# Altium schematic sheet micro.SchDoc
size A3
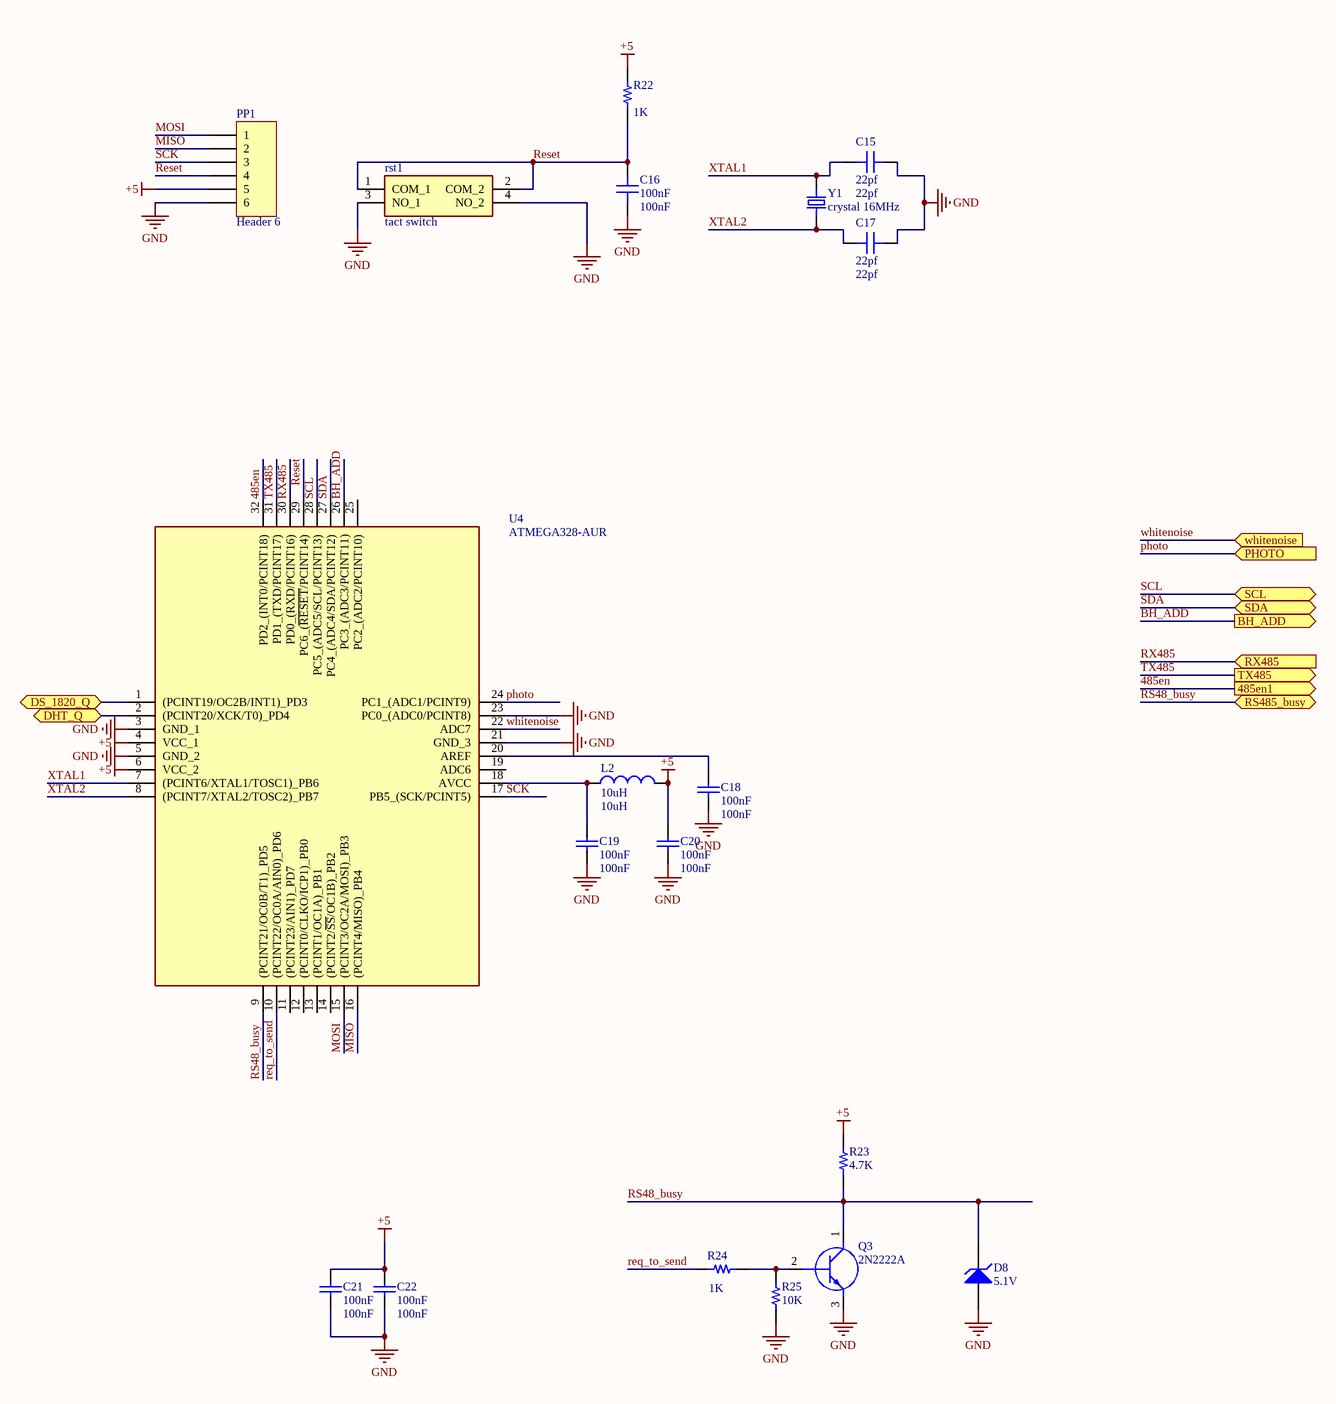
[diagram p0: micro.SchDoc]

## Parts
C15  22pf  [0603C]
C16  100nF  [0603C]
C17  22pf  [0603C]
C18  100nF  [0603C]
C19  100nF  [0603C]
C20  100nF  [0603C]
C21  100nF  [0603C]
C22  100nF  [0603C]
D8  5.1V  [Diode 1n4148 SMD]
L2  10uH  [IND1206]
PP1  Header 6  [HDR1X6]
Q3  2N2222A  [soT95p280x130-3n]
R22  1K  [0603R]
R23  4.7K  [0603R]
R24  1K  [0603R]
R25  10K  [0603R]
rst1  tact switch  [DTSM63NVB]
U4  ATMEGA328-AUR  [TQFP32_N]
Y1  crystal 16MHz  [XTAL_ECS-180-S-5P-DN-TR]

## Ports
485en1 (out), BH_ADD (out), DHT_Q (bidir), DS_1820_Q (bidir), PHOTO (in), RS485_busy (bidir), RX485 (in), SCL (bidir), SDA (bidir), TX485 (out), whitenoise (in)

## Nets
+5: C20.1 C21.1 C22.1 L2.2 PP1.5 R22.2 R23.1 U4.4(VCC_1) U4.6(VCC_2)
GND: C15.1 C16.2 C17.1 C18.2 C19.2 C20.2 C21.2 C22.2 D8.1(A) PP1.6 Q3.3(E) R25.2 rst1.3(NO_1) rst1.4(NO_2) U4.3(GND_1) U4.5(GND_2) U4.21(GND_3) U4.23(PC0_(ADC0/PCINT8))
485en: U4.32(PD2_(INT0/PCINT18)) ; port 485en1
BH_ADD: U4.26(PC3_(ADC3/PCINT11)) ; port BH_ADD
DHT_Q: U4.2((PCINT20/XCK/T0)_PD4) ; port DHT_Q
DS_1820_Q: U4.1((PCINT19/OC2B/INT1)_PD3) ; port DS_1820_Q
MISO: PP1.2 U4.16((PCINT4/MISO)_PB4)
MOSI: PP1.1 U4.15((PCINT3/OC2A/MOSI)_PB3)
photo: U4.24(PC1_(ADC1/PCINT9)) ; port PHOTO
req_to_send: R24.2 U4.10((PCINT22/OC0A/AIN0)_PD6)
Reset: C16.1 PP1.4 R22.1 rst1.1(COM_1) rst1.2(COM_2) U4.29(PC6_(~{RESET}/PCINT14))
RS48_busy: D8.2(K) Q3.1(C) R23.2 U4.9((PCINT21/OC0B/T1)_PD5) ; port RS485_busy
RX485: U4.30(PD0_(RXD/PCINT16)) ; port RX485
SCK: PP1.3 U4.17(PB5_(SCK/PCINT5))
SCL: U4.28(PC5_(ADC5/SCL/PCINT13)) ; port SCL
SDA: U4.27(PC4_(ADC4/SDA/PCINT12)) ; port SDA
TX485: U4.31(PD1_(TXD/PCINT17)) ; port TX485
whitenoise: U4.22(ADC7) ; port whitenoise
XTAL1: C15.2 U4.7((PCINT6/XTAL1/TOSC1)_PB6) Y1.2
XTAL2: C17.2 U4.8((PCINT7/XTAL2/TOSC2)_PB7) Y1.1
NetC18_1: C18.1 U4.20(AREF)
NetC19_1: C19.1 L2.1 U4.18(AVCC)
NetQ3_2: Q3.2(B) R24.1 R25.1

Not connected (* = marked no-connect by the designer): U4 11((PCINT23/AIN1)_PD7) 12((PCINT0/CLKO/ICP1)_PB0) 13((PCINT1/OC1A)_PB1) 14((PCINT2/~{SS}/OC1B)_PB2) 19(ADC6) 25(PC2_(ADC2/PCINT10))

## Library data of the parts
C15-C17 = Capacitor: CAP SMD 0603; Part Number: C0805X106K9RAC7800
  C15 C17: Value: 22pf
  C16: Value: 100nF
C18-C22 = Cap: CAP SMD 0603; Published: 8-Jun-2000; LatestRevisionDate: 17-Jul-2002; LatestRevisionNote: Re-released for DXP Platform.; PackageReference: RAD-0.3; Publisher: Altium Limited; PackageDescription: Radial Cap, Thru-Hole; 2 Leads; 0.3 in Pin Spacing; Value: 100nF
D8 = D Zener: Zener Diode 5.1v; Published: 8-Jun-2000; LatestRevisionDate: 17-Jul-2002; LatestRevisionNote: Re-released for DXP Platform.; PackageReference: DIODE-0.7; Publisher: Altium Limited; PackageDescription: Diode, Thru-Hole; 2 Leads; 0.7 in Pin Spacing
L2 = Inductor: Inductor 1206; Code_IEC: 1005; Published: 8-Jun-2000; LatestRevisionDate: 29-May-2009; LatestRevisionNote: IPC-7351 Footprint Added.; PackageReference: 0402-A; Publisher: Altium Limited; PackageDescription: Chip Inductor; Code_JEITA: 0402; Value: 10uH
PP1 = Header 6: Header, 6-Pin , female; LatestRevisionDate: 17-Jul-2002; LatestRevisionNote: Re-released for DXP Platform.; Publisher: Altium Limited
Q3 = 2N2222A: Transistor BJT NPN SMD; pin to pad: 1>3 2>1 3>2; Manufacturer_Name: Foshan Blue Rocket Elec; Datasheet Link: https://datasheet.lcsc.com/szlcsc/1901291437_Foshan-Blue-Rocket-Elec-2N2222A_C358533.pdf; Height: 4.7mm; Manufacturer_Part_Number: 2N2222A
R22-R25 = Resistor: RES SMD 0603; Part Number: RCS0805100KFKEA
  R22 R24: Value: 1K
  R23: Value: 4.7K
  R25: Value: 10K
rst1 = DTSM-66R-V-T_R: Push Button SMD - 4PIN; Manufacturer_Name: Diptronics; Manufacturer_Part_Number: DTSM-66R-V-T/R; Datasheet Link: https://www.mouser.co.uk/datasheet/2/910/464_DTSMJ-6-1571536.pdf; Height: 7.1mm; Mouser Part Number: 113-DTSM66RVTR; Mouser Price/Stock: https://www.mouser.co.uk/ProductDetail/Diptronics/DTSM-66R-V-T-R?qs=MLItCLRbWsxl2%252BVY862AIw%3D%3D
U4 = ATMEGA328-AUR: ATMEGA328p-SMD-LQFP32; Manufacturer_Name: Microchip; Datasheet Link: https://componentsearchengine.com/Datasheets/1/ATMEGA328-AUR.pdf; Height: 1.2mm; Manufacturer_Part_Number: ATMEGA328-AUR; Mouser Part Number: 556-ATMEGA328-AUR; Mouser Price/Stock: https://www.mouser.co.uk/ProductDetail/Microchip-Technology-Atmel/ATMEGA328-AUR?qs=lwdSMh1%2FoYLfe%252B5OKFEFrw%3D%3D; Arrow Part Number: ATMEGA328-AUR; Arrow Price/Stock: https://www.arrow.com/en/products/atmega328-aur/microchip-technology
Y1 = ECS-180-S-5P-DN-TR: Crystals 16MHz; MF: ECS International; MP: ECS-180-S-5P-DN-TR; Value: 16MHz; SnapEDA_Link: https://www.snapeda.com/parts/ECS-180-S-5P-DN-TR/ECS%20International/view-part/2547669/?ref=snap; Price: None; Package: HC49/US ECS International; Availability: Unavailable